# Altium schematic sheet 08-SwitchingRegulator.SchDoc
size A
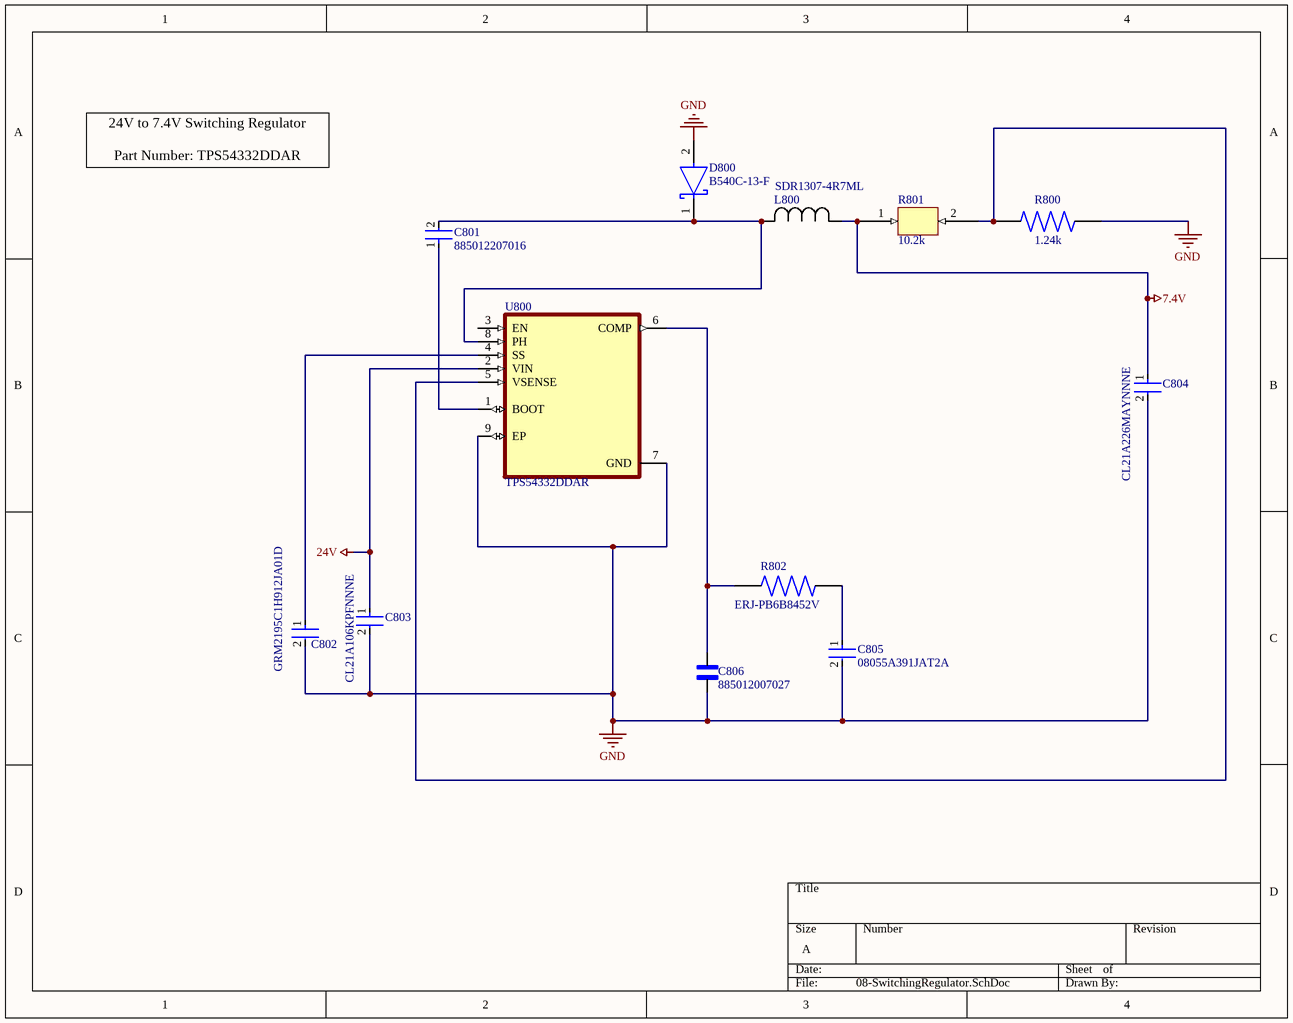
[diagram p0: 08-SwitchingRegulator.SchDoc]

## Parts
C801  885012207016  [FP-885012207016-MFG]
C802  GRM2195C1H912JA01D  [FP-GRM219-0_1-MFG]
C803  CL21A106KPFNNNE  [FP-CL21-IPC_B]
C804  CL21A226MAYNNNE  [FP-CL21-IPC_C]
C805  08055A391JAT2A  [FP-0805-L_2_01_0_2-W_1_25-IPC_C]
C806  885012007027  [WCAP-CSGP_885012007027]
D800  B540C-13-F  [FP-SMC-MFG]
L800  SDR1307-4R7ML  [IND_BOURNS_SDR1307]
R800  value 1.24k  [RES_ERJ1TNF1241U]  (hidden comment: ERJ-1TNF1241U)
R801  10.2k  [PCBComponent_1]
R802  ERJ-PB6B8452V  [RES_ERJ-PB6B1004V]
U800  TPS54332DDAR  [VREG_LM5017MR/NOPB]

## Nets
7.4V: C804.1 L800.1 R801.1
24V: C803.1 U800.2(VIN)
GND: C802.2 C803.2 C804.2 C805.2 C806.1 D800.2(A) R800.1 U800.7(GND) U800.9(EP)
NetC801_1: C801.1 U800.1(BOOT)
NetC801_2: C801.2 D800.1(C) L800.2 U800.8(PH)
NetC802_1: C802.1 U800.4(SS)
NetC805_1: C805.1 R802.1
NetC806_2: C806.2 R802.2 U800.6(COMP)
NetR800_2: R800.2 R801.2 U800.5(VSENSE)

Not connected (* = marked no-connect by the designer): U800 3(EN)

## Notes on the sheet
- 24V to 7.4V Switching Regulator
  Part Number: TPS54332DDAR

## Library data of the parts
C801 = CMP-207839-000050-1: CAP CER 0.1UF 10V X7R 0805; Capacitance: 100nF; Tolerance: 10%; Min Operating Temperature: -55°C; Series: WCAP-CSGP; Voltage Rating: 10V; Max Operating Temperature: 125°C; Case/Package: 0805; Thickness: 0.035inch; Case Code (Imperial): 0805; Width: 0.049inch; Case Code (Metric): 2012; Mount: Surface Mount; Packaging: Cut Tape; RoHS Compliant: Yes; Length: 0.079inch
C802 = CMP-2007-00147-2: Chip Multilayer Ceramic Capacitors for General Purpose, 0805, 9100pF, C0G, 30ppm/°C, 5%, 50V; Capacitance: 9.1nF; Voltage: 50V; Length: 2mm; Termination: SMD/SMT; Radiation Hardening: No; Mount: Surface Mount; Thickness: 0.037inch; Case/Package: 0805; Packaging: Tape and Reel; Case Code (Imperial): 0805; Package Quantity: 1; Voltage Rating (DC): 50V; Depth: 1.25mm; Lead Free: Lead Free; Dielectric: C0G; Voltage Rating: 50V; Tolerance: 5%; Height: 0.85mm; Max Operating Temperature: 125°C; Width: 0.049inch; Case Code (Metric): 2012; Min Operating Temperature: -55°C
C803 = CMP-2000-06103-2: CL21 Series 0805 10uF 10V ±10% Tolerance X5R Multilayer Ceramic Chip Capacitor; Case Code (Imperial): 0805; Capacitance: 10uF; Mount: Surface Mount; Depth: 1.25mm; Length: 2mm; Lead Free: Lead Free; Packaging: Tape and Reel; Dielectric: X5R; Width: 0.049inch; Package Quantity: 1; Height: 1.25mm; Case/Package: 0805; Voltage Rating: 10V; Thickness: 0.053inch; Max Operating Temperature: 85°C; Tolerance: 10%; Case Code (Metric): 2012; Contact Plating: Tin; Min Operating Temperature: -55°C; Radiation Hardening: No; Voltage Rating (DC): 10V
C804 = CMP-13271-003225-1: CL21 Series 0805 22uF 25V ±20% Tolerance X5R Multilayer Ceramic Chip Capacitor
C805 = CMP-2000-05807-2: General Purpose Ceramic Capacitor, 0805, 390pF, 5%, C0G, 30ppm/°C, 50V; Length: 2.01mm; Depth: 1.25mm; Max Operating Temperature: 125°C; Dielectric: C0G; RoHS Compliant: Yes; REACH SVHC: No SVHC; Voltage: 50V; Tolerance: 5%; Mount: Surface Mount; Thickness: 0.037inch; Contact Plating: Tin; Width: 1.25mm; Dielectric Material: Ceramic; Capacitance: 390pF; Min Operating Temperature: -55°C; Case Code (Metric): 2012; Package Quantity: 1; Lead Free: Lead Free; Voltage Rating: 50V; Height: 0.94mm; Number of Pins: 2; Termination: SMD/SMT; Radiation Hardening: No; Temperature Coefficient: 30ppm/°C; Case/Package: 0805; Packaging: Tape and Reel; Voltage Rating (DC): 50V; Case Code (Imperial): 0805
C806 = 885012007027: <b> WCAP-CSGP Ceramic Capacitors <br> <br> <br><b>Characteristics </b><br> </b><br>Multilayer Ceramic Chip Capacitor <br>Recommended soldering:Reflow, for 0603 and 0805 wave soldering is also allowed <br>Operating temperature:-55 Â°C to +125 Â°C; <br>Ceramic characteristics: Class I - NPO ; Class II -X7R, X5R <br>High performance ceramic <br>High capacitance stability <br>Minimal aging  <br>Termination:Cu/Ni/Sn <br>   <br><a href="http://katalog.we-online.de/media/images/eisos/WCAP-CSGP_pf2.jpg" title="Enlarge picture"> <img src="http://katalog.we-online.de/media/thumbs2/eisos/thb_WCAP-CSGP_pf2.jpg" width="320"></a><p> Details see: <a href="http://katalog.we-online.de/en/pbs/WCAP-CSGP-0805?">http://katalog.we-online.de/en/pbs/WCAP-CSGP-0805? </a><p>Created:  2015-01-28 <br>2015 (C) Wurth Elektronik; Package: None; Price: None; Value: *; MP: 885012007027; Availability: Unavailable; Supplier 1: Digi-Key; Supplier Part Number 1: 732-7826-1-ND
D800 = CMP-2000-05097-3: DIODE SCHOTTKY 40V 5A SMC; Manufacturer: Diodes Inc.; Automotive Grade: NA; Peak Reverse Current: 0.5mA; Value: 300pF; Max Junction Temp: +150°C; Max Surge Forward Current: 100A; Standoff Height: 0.1mm; Digikey Description: DIODE SCHOTTKY 40V 5A SMC; Temperature Range Low: -55°C; Manufacturer Part Number: B540C-13-F; Octopart: https://octopart.com/b540c-13-f-diodes+inc.-325873; Lead Free: Yes; Reverse Voltage: 40V; RoHS: TRUE; Category: Diode; Mouser Description: Diode: Schottky rectifying; SMD; 40V; 5A; SMC; Package: reel, tape; ComponentLink2Description: Datasheet; Temperature Range High: +150°C; Automotive: No; Footprint Url: https://www.diodes.com/assets/Package-Files/SMC.pdf; Device Class L3: Schottky Diodes; Height: 2.5mm; Forward Current: 5A; Temperature: -55°C to +150°C; Package: SMC; ComponentLink2URL: https://www.diodes.com/assets/Datasheets/ds13012.pdf; Device Class L2: Diodes; Max Repetitive Reverse Voltage: 40V; Device Class L1: Discrete Semiconductors; Capacitance: 300pF
L800 = SDR1307-4R7ML: No Description Available; Mfr_Name: Bourns Electronics; Copyright: Copyright (C) 2023 Ultra Librarian. All rights reserved.; Manufacturer_Part_Number: SDR1307-4R7ML; Digi-Key_Part_Number_1: SDR1307-4R7MLCT-ND; Digi-Key_Part_Number_2: SDR1307-4R7MLDKR-ND; Digi-Key_Part_Number_3: SDR1307-4R7MLTR-ND; Supplier 1: Digi-Key; Supplier Part Number 1: SDR1307-4R7MLCT-ND
R800 = ERJ1TNF1241U: MP: ERJ1TNF1241U; Availability: Unavailable; Package: None; Price: None
R801 = Component_2
R802 = ERJ-PB6B8452V: MF: {'manufacturer': u'Panasonic'}; MP: ERJ-PB6B8452V; Availability: Unavailable; Package: None; Value: *; Price: None; Supplier 1: Digi-Key; Supplier Part Number 1: P20814CT-ND
U800 = TPS54332DDAR: 3.5V to 28V Input, 3.5A, 1MHz Step-Down Converter with Eco-mode; MF: Texas Instruments; Check_prices: https://www.snapeda.com/parts/TPS54332DDAR/Texas+Instruments/view-part/?ref=eda; Value: *; MP: TPS54332DDAR; Purchase-URL: https://pricing.snapeda.com/search/part/TPS54332DDAR/?ref=eda; SnapEDA_Link: https://www.snapeda.com/parts/TPS54332DDAR/Texas+Instruments/view-part/?ref=snap; Package: HSOIC-8 Texas Instruments; Digi-Key_Part_Number: 296-39420-2-ND